# EAGLE design lc-meter (EAGLE 5.07)
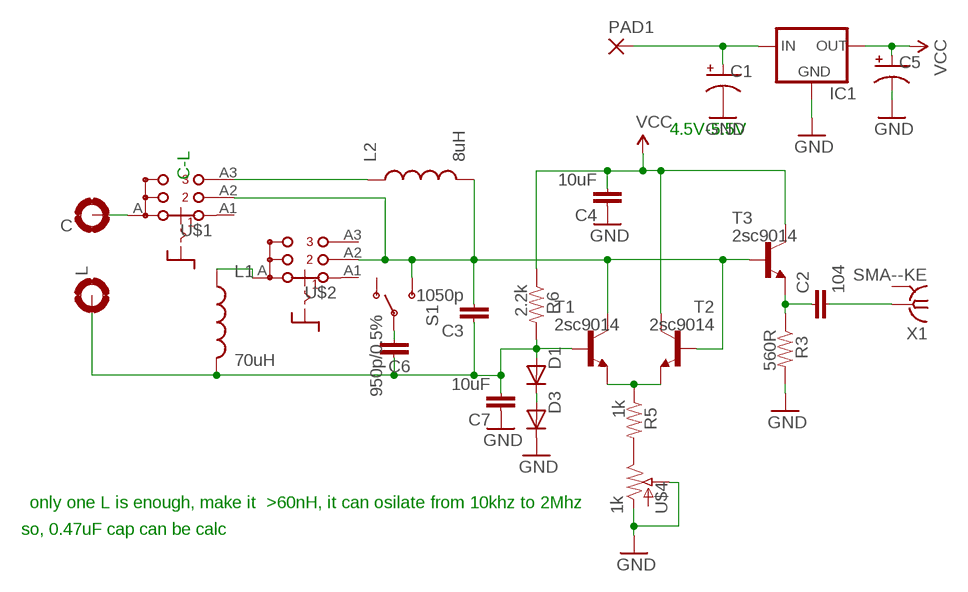
[diagram p0: schematic, sheet 1]

## Parts
C  MOUNT-PAD-ROUND3.0  [3,0-PAD]
C1  CAP_POLPTH1  [CPOL-RADIAL-100UF-25V]
C2  104  CAPPTH1  [CAP-PTH-5MM]
C3  1050p  CAPPTH3  [CAP-PTH-LARGE]
C4  10uF  CAPPTH1  [CAP-PTH-5MM]
C5  CAP_POLPTH1  [CPOL-RADIAL-100UF-25V]
C6  950p/0.5%  CAPPTH3  [CAP-PTH-LARGE]
C7  10uF  CAPPTH1  [CAP-PTH-5MM]
D1  DIODE1206  [1206-DIODE]
D3  DIODE1206  [1206-DIODE]
IC1  V_REG_78XX-TO-220  [TO-220-ALT]
L  MOUNT-PAD-ROUND3.0  [3,0-PAD]
L1  70uH  COILL7.5  [L-7,5]
L2  8uH  COILL12.5  [L-12,5]
PAD1  3,17/1,1  [3,17/1,1]
R3  560R  RESISTOR0207/7(1/4W)  [0207/7]
R5  1k  RESISTOR0207/7(1/4W)  [0207/7]
R6  2.2k  RESISTOR0207/7(1/4W)  [0207/7]
S1  SWITCH-SPST3AM6  [SWITCH-SPDT-AM#6]
T1  2sc9014  -NPN-TO92-EBC  [TO92-EBC]
T2  2sc9014  -NPN-TO92-EBC  [TO92-EBC]
T3  2sc9014  -NPN-TO92-EBC  [TO92-EBC]
U$1  ROTATE-SWICH-1X3P  [ROT-SWITCH-1X3-PANNEL]
U$2  ROTATE-SWICH-1X3P  [ROT-SWITCH-1X3-PANNEL]
U$4  1k  POTB25P-3362P  [B25P]
X1  SMA--KE  [SMA-KE]

## Nets
GND: C1.2(-) C4.1 C5.2(-) C7.1 D3.K(C) IC1.GND R3.2 U$4.A U$4.S
N$1: C3.2 L2.2 S1.3(S) T1.C T2.B T3.B U$1.A2 U$2.A2
N$2: R5.2 U$4.E
N$3: R5.1 T1.E T2.E
N$4: D1.K(C) D3.A
N$5: L1.1 U$2.A
N$6: C2.2 X1.1
N$7: C1.1(+) IC1.IN PAD1.1(P)
N$8: C3.1 C6.1 C7.2 D1.A L1.2 L.B3,0(MOUNT) R6.2 T1.B
N$9: C.B3,0(MOUNT) U$1.A
N$10: C2.1 R3.1 T3.E
N$11: L2.1 U$1.A3
N$12: C6.2 S1.2(P)
VCC: C4.2 C5.1(+) IC1.OUT R6.1 T2.C T3.C
Unconnected: S1.1(O) U$1.A1 U$2.A1 U$2.A3

## Notes on the sheet
- 4.5V-5.5V
- C-L
- only one L is enough, make it  >60nH, it can osilate from 10khz to 2Mhz
- so, 0.47uF cap can be calc

## Power pins joined to a net without a drawn wire
GND: X1.G@1(GND) X1.G@2(GND) X1.G@3(GND) X1.G@4(GND)

## Library data of the parts
C L = holes:MOUNT-PAD-ROUND: MOUNTING PAD, round
C1 C5 = digital-toy:CAP_POL: Capacitor Polarized These are standard SMD and PTH capacitors. Normally 10uF, 47uF, and 100uF in electrolytic and tantalum varieties. Always verify the external diameter of the through hole cap, it varies with capacity, voltage, and manufacturer. The EIA devices should be standard. PANASONIC_D size: 6.5mmx6.5mmx5.5mm, 100uf (taobao:6.3mmx5.5mm), same as CVL0605 153cvl0405 size: 4mmx4mmx5.5mm, 10uf (taobao:4mmx5.5mm) ct6032 typical 47uF Tantalum, comment by hyl.
C2-C4 C6 C7 = digital-toy:CAP: Capacitor Standard 0603 ceramic capacitor, and 0.1" leaded capacitor.
D1 D3 = digital-toy:DIODE: Diode These are standard reverse protection diodes and small signal diodes. SMA package can handle up to about 1A. SOD-323 can handle about 200mA. What the SOD-323 package when ordering, there are some mfgs out there that are 5-pin packages.
IC1 = SparkFun:V_REG_78XX: Voltage Regulator Standard 7805 5V regulator. IGO (Input Ground Output). Spark Fun Electronics SKU : COM-00107
L1 L2 = dtoy-RF:COIL
PAD1 = wirepad:3,17/1,1: THROUGH-HOLE PAD
R3 R5 R6 = digital-toy:RESISTOR: Resistor Basic schematic elements and footprints for 0603, 1206, and PTH 1/10th watt (small) resistors. digital-toy copy vertical mount of axial-0.3 from rcl.lbr : the 0207/xx 3W resistor: 0617/17, 0617/22, 0617V
S1 = digital-toy:SWITCH-SPST: SPST Switch Simple slide switch. Spark Fun Electronics SKU : COM-00102
T1-T3 = digital-toy:*-NPN-: NPN Transistror most of sot-23 use the pacages sot23-BEC, top C, left B, right E. by hyl, digital-toy. and to-92 use ebc(from-top) by hyl, digital-toy.
U$1 U$2 = digital-toy:ROTATE-SWICH-1X3
U$4 = digital-toy:POT: POT digital toy POT, 3296 multi turn, blue-white ... hyl 8/07/2001
X1 = dtoy-RF:SMA-: SMA 50 Ohm End Launch Jack Receptacle - Round Contact Johnson Components Source: www.johnsoncomponents.com .. J502-ND.pdf

## Board
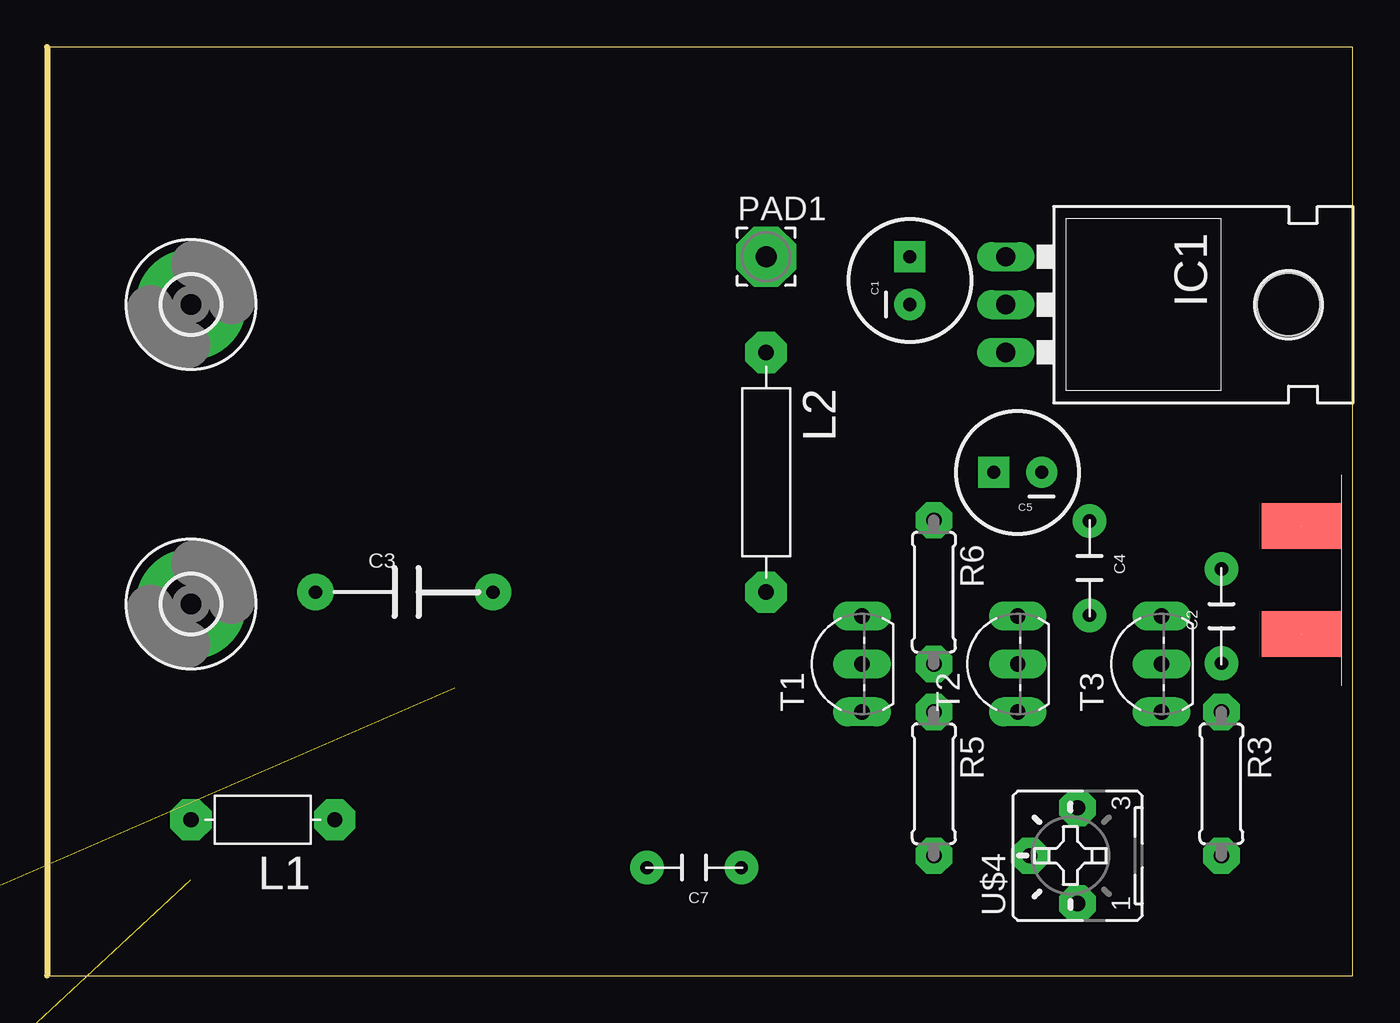
[diagram p1: board, top side]
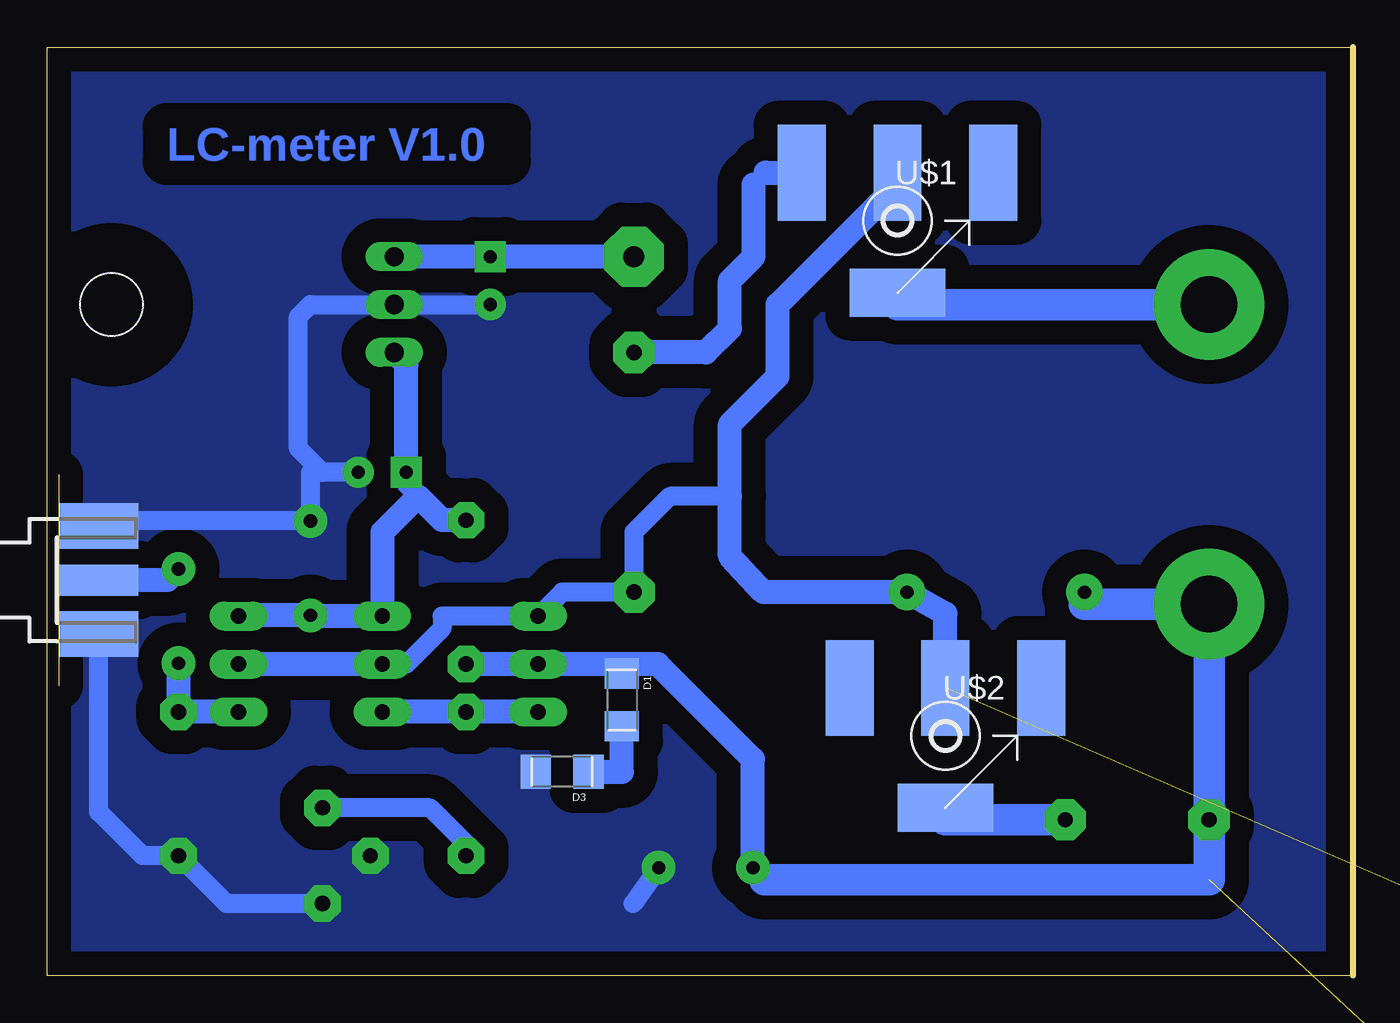
[diagram p2: board, bottom side, seen from below]

Size 69.19 x 49.2 mm. Coordinates in mm from the lower left corner, seen from the top.
Outline: 0,0 69.19,0 69.19,49.2 0,49.2 0,0
Copper layers (1*16): Top 0.035mm / dielectric 1.5mm / Bottom 0.035mm
Design rules "default": minimum track width 10mil, minimum drill 24mil, track to track 8mil, track to pad 8mil, pad to pad 8mil, via to via 8mil, smd to smd 8mil, copper to edge 40mil, drill to drill 8mil, minimum pad ring 10mil, minimum via ring 8mil, stop-mask expansion 4mil, vias tented up to drill 0mil, thermal gap 10mil

### Footprints (pad centres in the part's own frame; a part is rotated, then mirrored left to right if it is on the bottom)
3,0-PAD = drill 3 pad 5.842 round: B3,0 0,0
CPOL-RADIAL-100UF-25V = drill 0.7 pad 1.651 square: 1 1.27,0 | drill 0.7 pad 1.651 round: 2 -1.27,0
CAP-PTH-5MM = drill 0.7 pad 1.778 round: 1 -2.5,0; 2 2.5,0
CAP-PTH-LARGE = drill 0.7 pad 1.93 round: 1 -4.826,0; 2 4.572,0
1206-DIODE = smd 1.6 x 1.8: A -1.4,0; K 1.4,0
TO-220-ALT = drill 1.016 long: GND 0,-3.81; IN -2.54,-3.81; OUT 2.54,-3.81 | hole 3.302: 0,11.176
L-7,5 = drill 0.813 pad 2.184 octagon: 1 -3.81,0; 2 3.81,0
L-12,5 = drill 0.813 pad 2.184 octagon: 1 -6.35,0; 2 6.35,0
3,17/1,1 = drill 1.118 pad 3.175 octagon: 1 0,0
0207/7 = drill 0.813 pad 1.93 octagon: 1 -3.81,0; 2 3.81,0
SWITCH-SPDT-AM#6 = drill 0.762 pad 1.27 long: 1 0,2; 2 0,0; 3 0,-2 | drill 1.15 pad 2.184 square: P$1 0,-4.445; P$2 0,4.445
TO92-EBC = drill 0.813 pad 1.524 long: B 0,-1.27; C 2.54,-1.27; E -2.54,-1.27
ROT-SWITCH-1X3-PANNEL = smd 5.08 x 2.54: A 0,3.81 | smd 2.54 x 5.08: A1 -5.08,-2.54; A2 0,-2.54; A3 5.08,-2.54
B25P = drill 0.813 pad 1.93 octagon: A -2.54,0; E 2.54,0; S 0,2.54
SMA-KE = smd 4.191 x 1.651: 1 2.115,0 | smd 4.191 x 2.413: G@1 2.115,2.86; G@2 2.115,-2.86 | smd 4.191 x 2.413 bottom: G@3 2.115,2.86; G@4 2.115,-2.86

### Placement (x,y rotation side)
C  7.62,35.56 0 top
C1  45.72,36.83 90 top
C2  62.23,19.05 90 top
C3  19.05,20.32 0 top
C4  55.24,21.59 270 top
C5  51.44,26.67 180 top
C6  -1.27,-7.62 0 top  (outside the outline)
C7  34.29,5.71 180 top
D1  38.73,14.61 270 bottom
D3  41.91,10.79 180 bottom
IC1  54.61,35.56 270 top
L  7.62,19.68 0 top
L1  11.43,8.26 180 top
L2  38.1,26.67 270 top
PAD1  38.1,38.1 0 top
R3  62.23,10.16 270 top
R5  46.99,10.16 270 top
R6  46.99,20.32 270 top
S1  -15.24,1.27 0 top  (outside the outline)
T1  41.91,16.51 90 top
T2  50.16,16.51 90 top
T3  57.78,16.51 90 top
U$1  24.13,40.01 180 bottom
U$2  21.59,12.7 180 bottom
U$4  54.61,6.35 90 top
X1  68.58,20.95 0 bottom

### Tracks (layer width: path | path; a pad name or v marks a point on that pad's centre or on a via)
GND  (2 unrouted)
  Bottom 1.016: C7.1 38.14,3.81 | C5.2 54.61,26.67 54.93,26.99 | 54.93,26.99 55.88,27.94 55.88,34.92 55.24,35.56 IC1.GND C1.2 | 54.93,26.99 55.24,26.67 C4.1 66.19,24.09 X1.G@3 | X1.G@4 66.47,8.68 64.14,6.35 R3.2 59.69,3.81 U$4.A
  pour Bottom (isolate 1.27, no thermals): -7.62,1.91 -7.62,44.45 -2.54,52.07 70.48,52.07 74.93,42.55 74.93,1.91 67.94,-5.08 -0.64,-5.08
N$1  (1 unrouted)
  Bottom 0.813: 24.13,41.91 U$1.A2
  Bottom 1.016: 33.02,25.4 36.2,25.4 38.1,23.5 L2.2 41.91,20.32 T1.C 48.26,19.05 48.26,18.41 50.16,16.51 T2.B
  Bottom 1.27: U$2.A2 21.59,19.18 C3.2 31.24,20.32 33.02,22.23 33.02,25.4 33.02,29.21 30.48,31.75 30.48,35.56 24.13,41.91 | T2.B T3.B
N$2
  Bottom 1.016: R5.2 46.99,6.99 48.9,8.89 U$4.E
N$3
  Bottom 1.27: T2.E R5.1 T1.E
N$4
  Bottom 1.27: D1.K 38.73,10.79 D3.A
N$5
  Bottom 1.676: U$2.A 21.59,8.26 L1.1
N$6
  Bottom 1.27: X1.1 62.83,20.95 C2.2
N$7
  Bottom 1.27: PAD1.1 C1.1 IC1.IN
N$8  (1 unrouted)
  Bottom 1.016: 31.16,5.08 C7.2
  Bottom 1.27: R6.2 T1.B 38.23,16.51 | C7.2 31.79,11.47 36.83,16.51 38.23,16.51 | 38.23,16.51 D1.A
  Bottom 1.676: 31.16,5.08 7.62,5.08 L1.2 L.B3,0 14.22,19.68 C3.1
N$9
  Bottom 1.676: U$1.A 24.13,35.56 C.B3,0
N$10
  Bottom 1.27: T3.E R3.1 C2.1
N$11
  Bottom 0.813: 31.75,41.91 31.11,42.55
  Bottom 1.27: 31.11,42.55 U$1.A3 | 31.75,41.91 31.75,38.1 33.02,36.83 33.02,34.29 34.29,33.02 L2.1
N$12  (1 unrouted)
VCC
  Bottom 1.016: 49.53,25.4 50.16,26.04 C5.1 | 55.2,19.05 C4.2 | 59.02,19.09 T3.C
  Bottom 1.27: R6.1 48.26,24.13 49.53,25.4 51.44,23.5 T2.C 55.2,19.05 | C5.1 50.16,32.38 IC1.OUT | C4.2 59.02,19.09

### Text on the board
Bottom: LC-meter V1.0